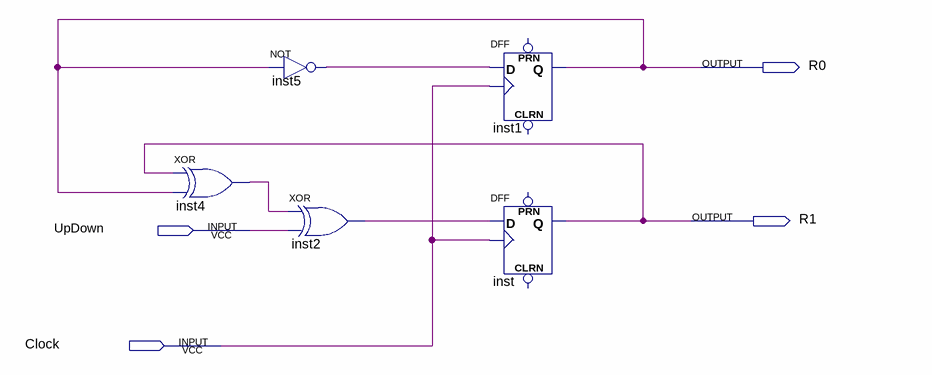
[diagram p0: schematic sheet]
// Quartus schematic UpDown-Counter.bdf as structural Verilog: 5 symbols, 4 pins
module \UpDown-Counter  (
  input  UpDown,
  input  Clock,
  output R0,
  output R1
);

  wire inst2_out, inst4_out, inst5_out;

  xor inst4 (inst4_out, R1, R0);
  not inst5 (inst5_out, R0);
  xor inst2 (inst2_out, inst4_out, UpDown);
  DFF inst1 (.CLK(Clock), .D(inst5_out), .Q(R0));  // open: CLRN, PRN
  DFF inst (.CLK(Clock), .D(inst2_out), .Q(R1));  // open: CLRN, PRN
endmodule
